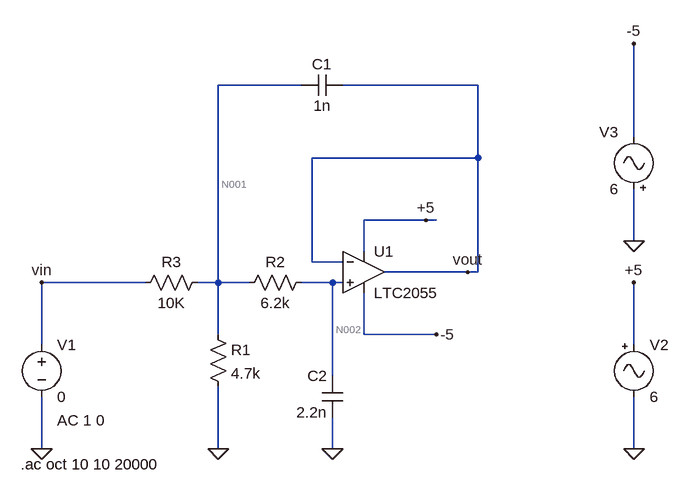
[diagram p0: schematic single_ended_ltc_driver.asc]
single_ended_ltc_driver.asc, the LTspice schematic file:
Version 4
SHEET 1 940 680
WIRE 240 -32 112 -32
WIRE 512 -32 304 -32
WIRE 752 48 752 -96
WIRE 512 80 512 -32
WIRE 512 80 256 80
WIRE 432 176 336 176
WIRE 448 176 432 176
WIRE 752 208 752 128
WIRE 336 224 336 176
WIRE 256 240 256 80
WIRE 304 240 256 240
WIRE 496 256 368 256
WIRE 512 256 512 80
WIRE 512 256 496 256
WIRE 0 272 -160 272
WIRE 112 272 112 -32
WIRE 112 272 80 272
WIRE 160 272 112 272
WIRE 288 272 240 272
WIRE 304 272 288 272
WIRE 112 352 112 272
WIRE 336 352 336 288
WIRE 448 352 336 352
WIRE -160 368 -160 272
WIRE 752 368 752 272
WIRE 288 416 288 272
WIRE -160 528 -160 448
WIRE 112 528 112 432
WIRE 288 528 288 480
WIRE 752 528 752 448
FLAG 112 528 0
FLAG 288 528 0
FLAG -160 528 0
FLAG 752 528 0
FLAG 752 208 0
FLAG 752 272 +5
FLAG 432 176 +5
FLAG 752 -96 -5
FLAG 448 352 -5
FLAG -160 272 vin
FLAG 496 256 vout
SYMBOL res 96 336 R0
SYMATTR InstName R1
SYMATTR Value 4.7k
SYMBOL res 256 256 R90
WINDOW 0 0 56 VBottom 0
WINDOW 3 32 56 VTop 0
SYMATTR InstName R2
SYMATTR Value 6.2k
SYMBOL res -16 288 R270
WINDOW 0 32 56 VTop 0
WINDOW 3 0 56 VBottom 0
SYMATTR InstName R3
SYMATTR Value 10K
SYMBOL cap 304 -48 R90
WINDOW 0 -1 32 VBottom 0
WINDOW 3 32 32 VTop 0
SYMATTR InstName C1
SYMATTR Value 1n
SYMBOL cap 304 480 R180
WINDOW 0 24 64 Left 0
WINDOW 3 24 8 Left 0
SYMATTR InstName C2
SYMATTR Value 2.2n
SYMBOL Misc\\signal 752 352 R0
WINDOW 123 0 0 Left 0
WINDOW 39 0 0 Left 0
SYMATTR InstName V2
SYMATTR Value 6
SYMBOL Misc\\signal 752 144 R180
WINDOW 0 24 104 Left 0
WINDOW 3 24 16 Left 0
WINDOW 123 0 0 Left 0
WINDOW 39 0 0 Left 0
SYMATTR InstName V3
SYMATTR Value 6
SYMBOL Opamps\\LTC2055 336 256 R0
SYMATTR InstName U1
SYMBOL voltage -160 352 R0
WINDOW 123 24 132 Left 0
WINDOW 39 0 0 Left 0
SYMATTR Value2 AC 1 0
SYMATTR InstName V1
SYMATTR Value 0
TEXT -192 552 Left 0 !.ac oct 10 10 20000

The netlist it stands for:
* single_ended_ltc_driver.asc
R1 N001 0 4.7k
R2 N002 N001 6.2k
R3 vin N001 10K
C1 vout N001 1n
C2 0 N002 2.2n
V2 +5 0 6
V3 0 -5 6
XU1 N002 vout vout +5 -5 LTC2054  ; LTC2055, pins In+ In- OUT V+ V-
V1 vin 0 0 AC 1 0
.ac oct 10 10 20000
.lib LTC2.lib
.backanno
.end

* Results of the author's LTspice run, read from the files saved beside the schematic
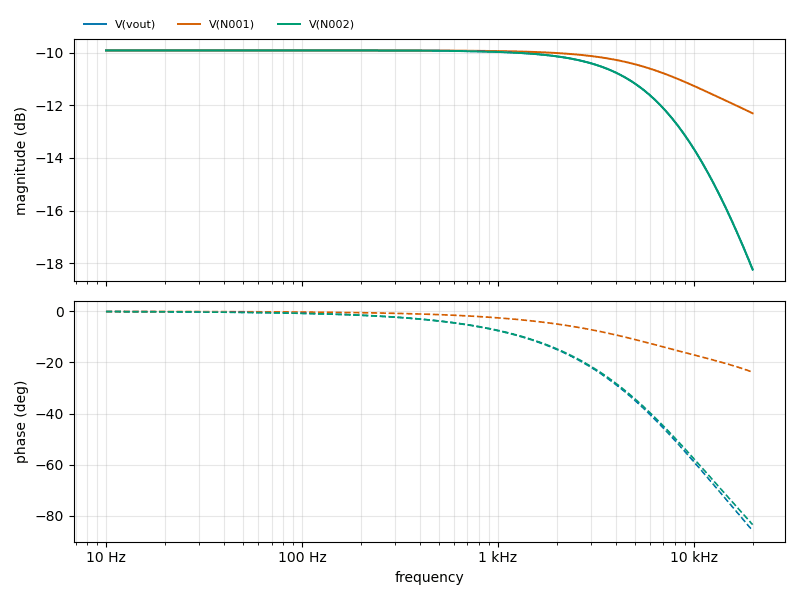
[diagram p1: AC Analysis of single_ended_ltc_driver.asc, plotted from the saved traces]
* AC Analysis, 1 run:
*   V(vout): -9.90 dB at 10 Hz, -18.24 dB at 20 kHz, peak -9.90 dB at 10 Hz, 3 dB below the peak at 8.581 kHz
*   V(N001): -9.90 dB at 10 Hz, -12.30 dB at 20 kHz, peak -9.90 dB at 10 Hz
*   V(N002): -9.90 dB at 10 Hz, -18.25 dB at 20 kHz, peak -9.90 dB at 10 Hz, 3 dB below the peak at 8.577 kHz